# Altium project MT7688A_MODULE_TESTBOARD_DEMO.PrjPcb
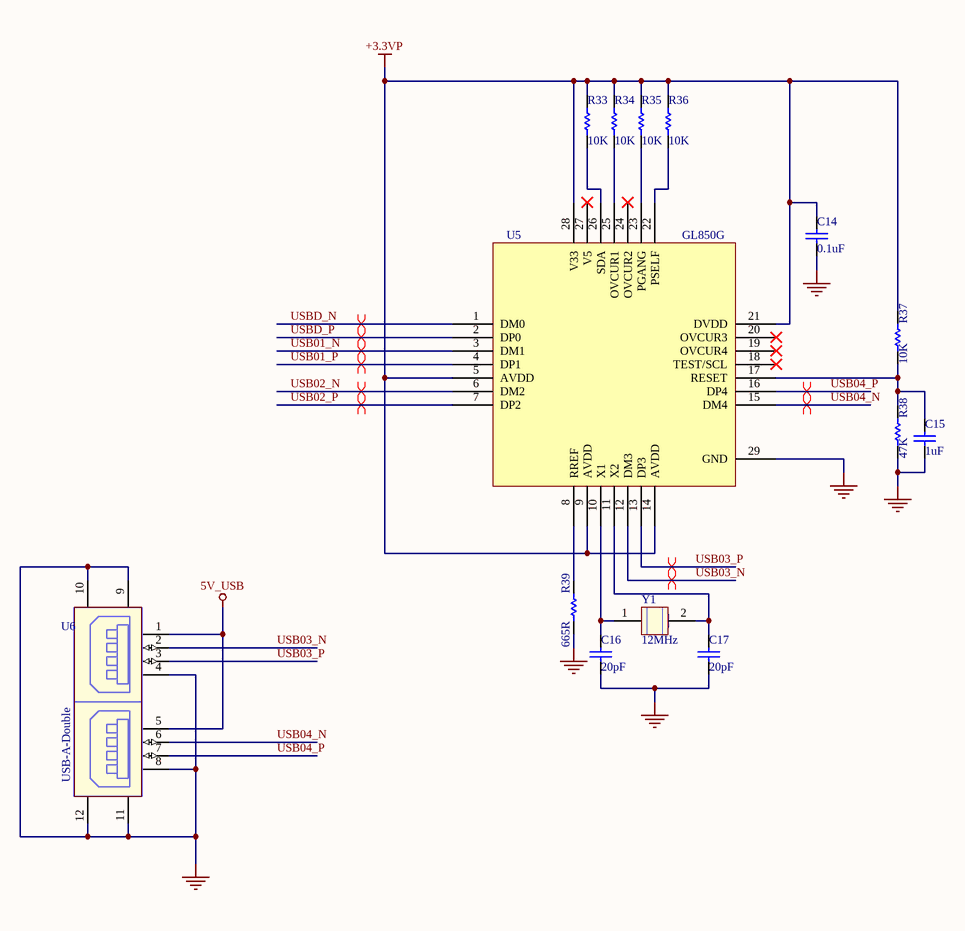
[diagram p0: GL850G.SchDoc]
5 sheets, 123 parts. Net scope: global (net labels, ports and power ports of the same name join across sheets).
Sheets:
  GL850G.SchDoc
  connect.SchDoc
  PCIe.SchDoc
  wm8960.SchDoc
  power.SchDoc

## Sheet GL850G.SchDoc
size A4

### Parts
C14  value 0.1uF  [C0603L]  (hidden comment: Cap Semi)
C15  value 1uF  [C0603L]  (hidden comment: Cap Semi)
C16  value 20pF  [C0603L]  (hidden comment: Cap Semi)
C17  value 20pF  [C0603L]  (hidden comment: Cap Semi)
R33  value 10K  [R0603L]  (hidden comment: Res Semi)
R34  value 10K  [R0603L]  (hidden comment: Res Semi)
R35  value 10K  [R0603L]  (hidden comment: Res Semi)
R36  value 10K  [R0603L]  (hidden comment: Res Semi)
R37  value 10K  [R0603L]  (hidden comment: Res Semi)
R38  value 47K  [R0603L]  (hidden comment: Res Semi)
R39  value 665R  [R0603L]  (hidden comment: Res Semi)
U5  GL850G  [GL850G-QFN28]
U6  USB-A-Double  [USB-DB]
Y1  value 12MHz  [XTAL1]  (hidden comment: Oscillator)

### Nets
5V_USB: U6.1(V+) U6.5(NC)
+3.3VP: C14.1 R33.2 R34.2 R35.2 R36.2 R37.2 U5.5(AVDD) U5.9(AVDD) U5.14(AVDD) U5.21(DVDD) U5.28(V33)
GND: C14.2 C15.2 C16.2 C17.2 R38.1 R39.1 U5.29(GND) U6.4(G) U6.8(NC) U6.9 U6.10 U6.11 U6.12
USB01_N: U5.3(DM1)
USB01_P: U5.4(DP1)
USB02_N: U5.6(DM2)
USB02_P: U5.7(DP2)
USB03_N: U5.12(DM3) U6.2(D-)
USB03_P: U5.13(DP3) U6.3(D+)
USB04_N: U5.15(DM4) U6.6(NC)
USB04_P: U5.16(DP4) U6.7(NC)
USBD_N: U5.1(DM0)
USBD_P: U5.2(DP0)
NetC15_1: C15.1 R37.1 R38.2 U5.17(RESET)
NetC16_1: C16.1 U5.10(X1) Y1.1
NetC17_1: C17.1 U5.11(X2) Y1.2
NetR33_1: R33.1 U5.26(SDA)
NetR34_1: R34.1 U5.25(OVCUR1)
NetR35_1: R35.1 U5.23(PGANG)
NetR36_1: R36.1 U5.22(PSELF)
NetR39_2: R39.2 U5.8(RREF)

Not connected (* = marked no-connect by the designer): U5 18(TEST/SCL)* 19(OVCUR4)* 20(OVCUR3)* 24(OVCUR2)* 27(V5)*

### Layout directives
differential pair: USB01_N, USB01_P, USB02_N, USB02_P, USB03_N, USB03_P, USB04_N, USB04_P, USBD_N, USBD_P

### Library data of the parts
C14-C17 = Cap Semi: Capacitor (Semiconductor SIM Model); Published: 8-Jun-2000; LatestRevisionDate: 17-Jul-2002; LatestRevisionNote: Re-released for DXP Platform.; PackageReference: C1206; Publisher: Altium Limited
R33-R39 = Res Semi: Semiconductor Resistor; Published: 8-Jun-2000; LatestRevisionDate: 17-Jul-2002; LatestRevisionNote: Re-released for DXP Platform.; PackageReference: AXIAL-0.5; Publisher: Altium Limited

## Sheet connect.SchDoc
size A3
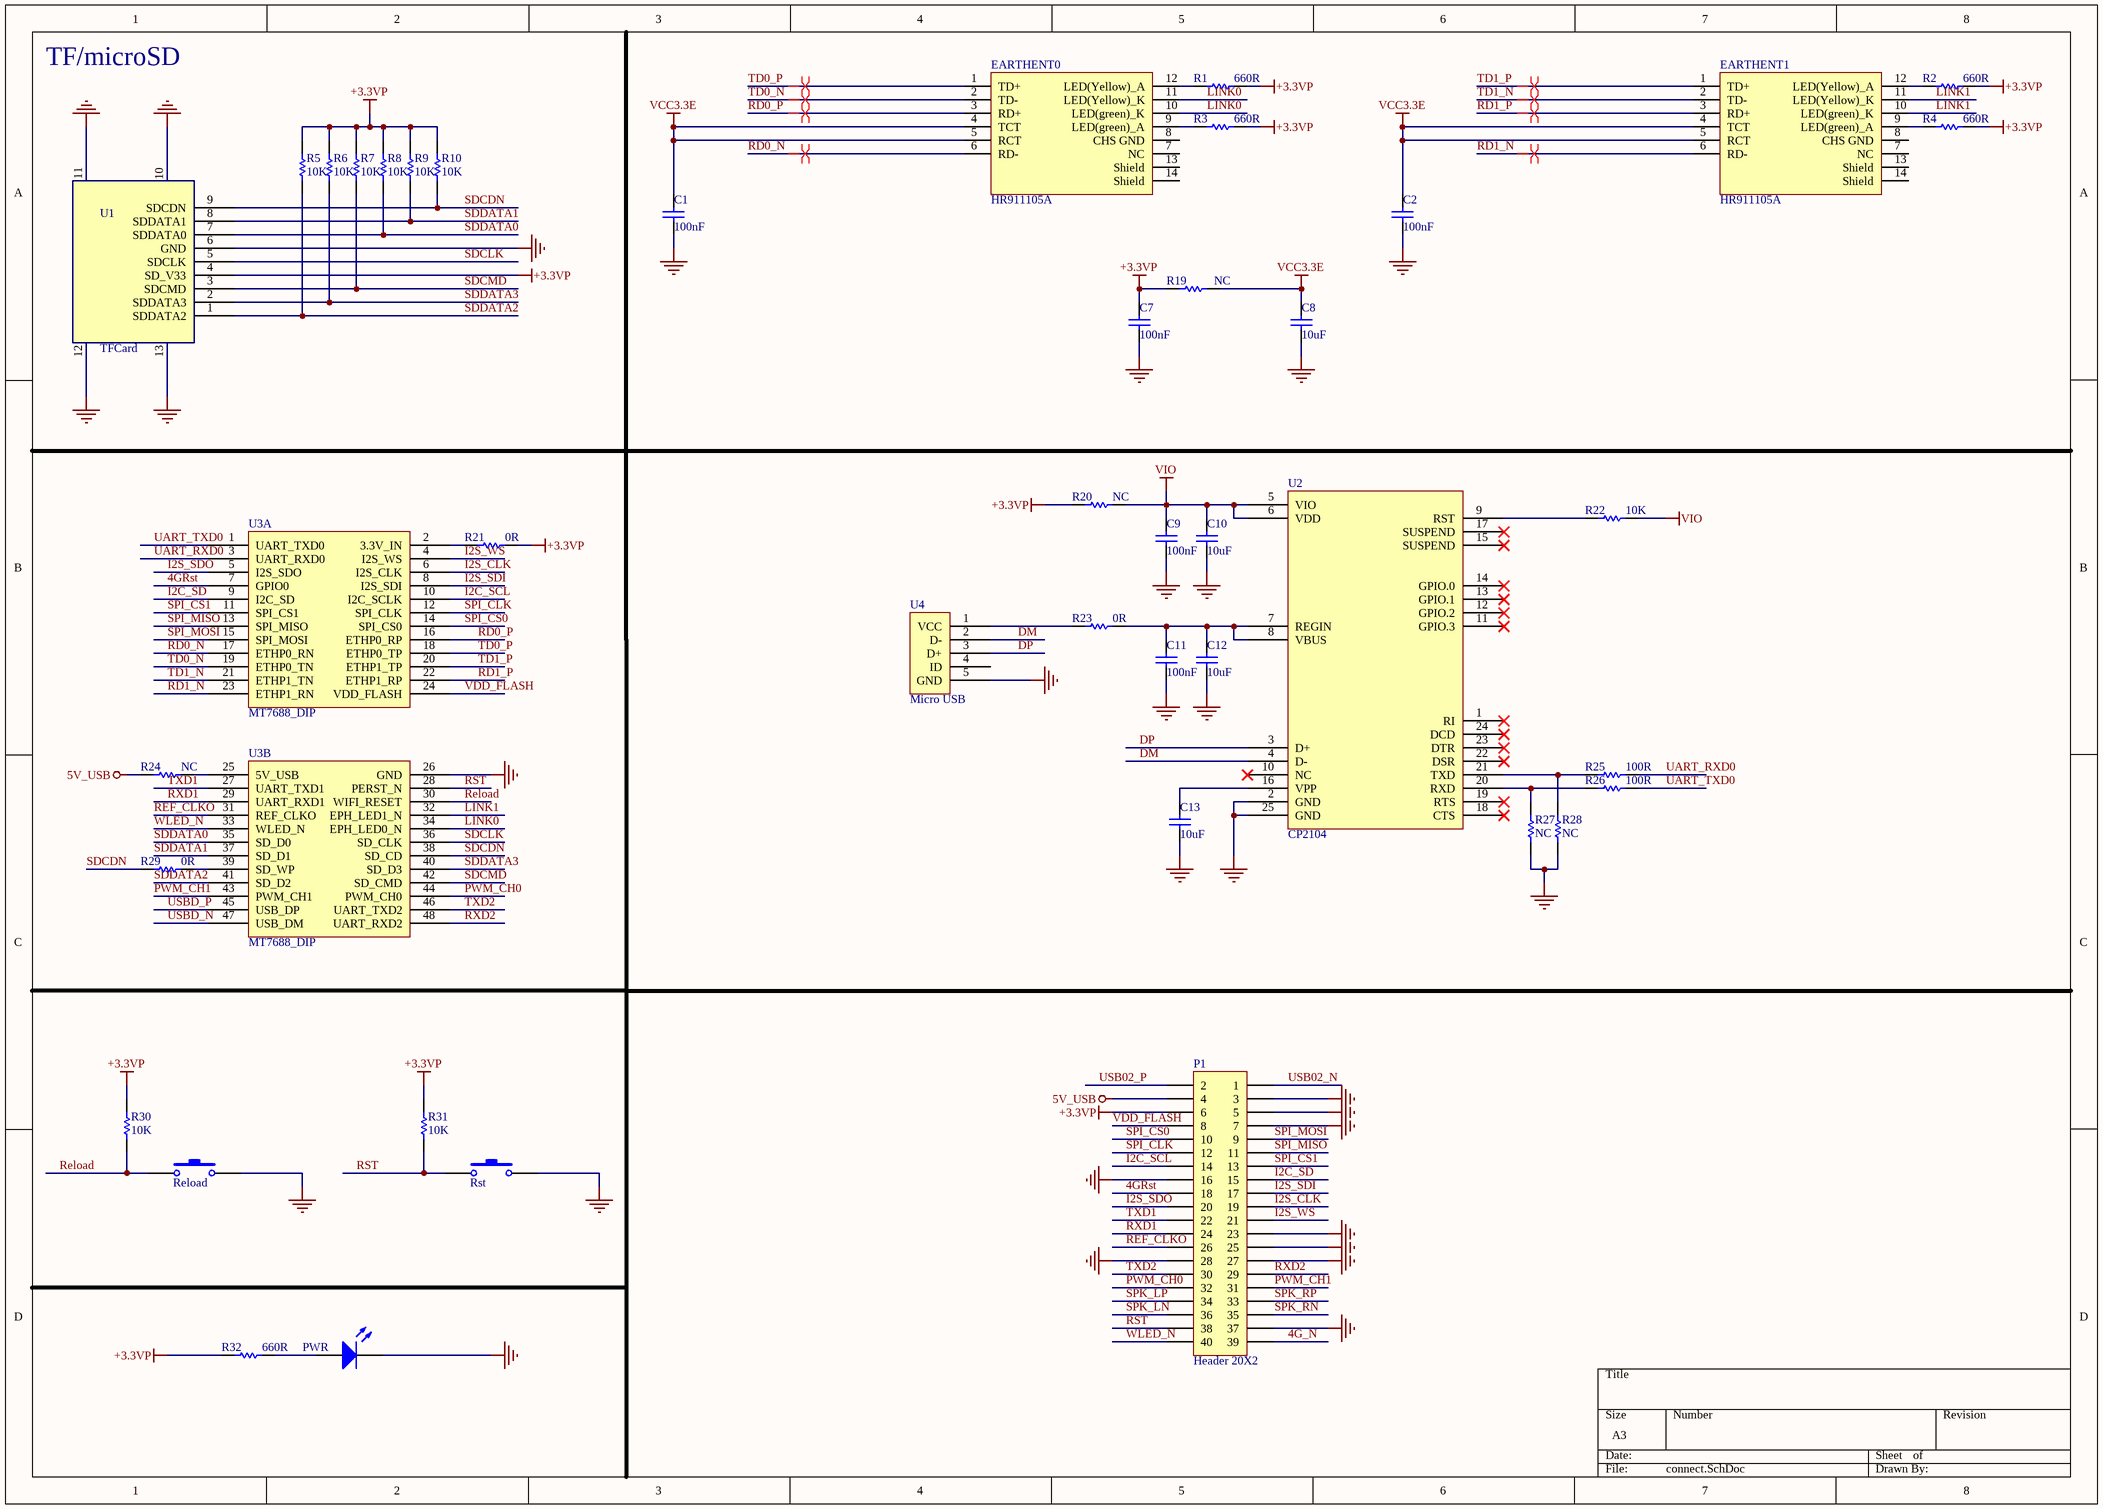
[diagram p1: connect.SchDoc]

### Parts
C1  value 100nF  [C0603L]  (hidden comment: Cap Semi)
C2  value 100nF  [C0603L]  (hidden comment: Cap Semi)
C7  value 100nF  [C0603L]  (hidden comment: Cap Semi)
C8  value 10uF  [C0603L]  (hidden comment: Cap Semi)
C9  value 100nF  [C0603L]  (hidden comment: Cap Semi)
C10  value 10uF  [C0603L]  (hidden comment: Cap Semi)
C11  value 100nF  [C0603L]  (hidden comment: Cap Semi)
C12  value 10uF  [C0603L]  (hidden comment: Cap Semi)
C13  value 10uF  [C0603L]  (hidden comment: Cap Semi)
EARTHENT0  HR911105A  [HR911105A]
EARTHENT1  HR911105A  [HR911105A]
P1  Header 20X2  [HDR2X20]
PWR  leds_0603  [0603LED]  (value not drawn)
R1  value 660R  [R0603L]  (hidden comment: Res Semi)
R2  value 660R  [R0603L]  (hidden comment: Res Semi)
R3  value 660R  [R0603L]  (hidden comment: Res Semi)
R4  value 660R  [R0603L]  (hidden comment: Res Semi)
R5  value 10K  [R0603L]  (hidden comment: Res Semi)
R6  value 10K  [R0603L]  (hidden comment: Res Semi)
R7  value 10K  [R0603L]  (hidden comment: Res Semi)
R8  value 10K  [R0603L]  (hidden comment: Res Semi)
R9  value 10K  [R0603L]  (hidden comment: Res Semi)
R10  value 10K  [R0603L]  (hidden comment: Res Semi)
R19  value NC  [R0603L]  (hidden comment: Res Semi)
R20  value NC  [R0603L]  (hidden comment: Res Semi)
R21  value 0R  [R0603L]  (hidden comment: Res Semi)
R22  value 10K  [R0603L]  (hidden comment: Res Semi)
R23  value 0R  [R0603L]  (hidden comment: Res Semi)
R24  value NC  [R0603L]  (hidden comment: Res Semi)
R25  value 100R  [R0603L]  (hidden comment: Res Semi)
R26  value 100R  [R0603L]  (hidden comment: Res Semi)
R27  value NC  [R0603L]  (hidden comment: Res Semi)
R28  value NC  [R0603L]  (hidden comment: Res Semi)
R29  value 0R  [R0603L]  (hidden comment: Res Semi)
R30  value 10K  [R0603L]  (hidden comment: Res Semi)
R31  value 10K  [R0603L]  (hidden comment: Res Semi)
R32  value 660R  [R0603L]  (hidden comment: Res Semi)
Reload  key  [2x3SWD]  (value not drawn)
Rst  key  [2x3SWD]  (value not drawn)
U1  TFCard  [TFCard-1]
U2  CP2104  [QFN24_4X4]
U3  MT7688_DIP  [MT7688_DIP]  (parts A,B of 2)
U4  Micro USB  [USB-15B1]

### Nets
5V_USB: P1.4 R24.2
+3.3VP: C7.1 P1.6 R1.1 R2.1 R3.1 R4.1 R5.2 R6.2 R7.2 R8.2 R9.2 R10.2 R19.2 R20.2 R21.1 R30.2 R31.2 R32.2 U1.4(SD_V33)
GND: C1.2 C2.2 C7.2 C8.2 C9.2 C10.2 C11.2 C12.2 C13.2 P1.3 P1.5 P1.7 P1.16 P1.23 P1.25 P1.27 P1.28 P1.37 PWR.2(K) R27.2 R28.2 Reload.1 Rst.1 U1.6(GND) U1.10 U1.11 U1.12 U1.13 U2.2(GND) U2.25(GND) U3.26(GND) U4.5(GND)
VCC3.3E: C1.1 C2.1 C8.1 EARTHENT0.4(TCT) EARTHENT0.5(RCT) EARTHENT1.4(TCT) EARTHENT1.5(RCT) R19.1
VIO: C9.1 C10.1 R20.1 R22.1 U2.5(VIO) U2.6(VDD)
4G_N: P1.39
4GRst: P1.18 U3.7(GPIO0)
DM: U2.4(D-) U4.2(D-)
DP: U2.3(D+) U4.3(D+)
I2C_SCL: P1.14 U3.10(I2C_SCLK)
I2C_SD: P1.15 U3.9(I2C_SD)
I2S_CLK: P1.19 U3.6(I2S_CLK)
I2S_SDI: P1.17 U3.8(I2S_SDI)
I2S_SDO: P1.20 U3.5(I2S_SDO)
I2S_WS: P1.21 U3.4(I2S_WS)
LINK0: EARTHENT0.10(LED(green)_K) EARTHENT0.11(LED(Yellow)_K) U3.34(EPH_LED0_N)
LINK1: EARTHENT1.10(LED(green)_K) EARTHENT1.11(LED(Yellow)_K) U3.32(EPH_LED1_N)
PWM_CH0: P1.32 U3.44(PWM_CH0)
PWM_CH1: P1.31 U3.43(PWM_CH1)
RD0_N: EARTHENT0.6(RD-) U3.17(ETHP0_RN)
RD0_P: EARTHENT0.3(RD+) U3.16(ETHP0_RP)
RD1_N: EARTHENT1.6(RD-) U3.23(ETHP1_RN)
RD1_P: EARTHENT1.3(RD+) U3.22(ETHP1_RP)
REF_CLKO: P1.26 U3.31(REF_CLKO)
Reload: R30.1 Reload.2 U3.30(WIFI_RESET)
RST: P1.38 R31.1 Rst.2 U3.28(PERST_N)
RXD1: P1.24 U3.29(UART_RXD1)
RXD2: P1.29 U3.48(UART_RXD2)
SDCDN: R10.1 R29.2 U1.9(SDCDN) U3.38(SD_CD)
SDCLK: U1.5(SDCLK) U3.36(SD_CLK)
SDCMD: R7.1 U1.3(SDCMD) U3.42(SD_CMD)
SDDATA0: R8.1 U1.7(SDDATA0) U3.35(SD_D0)
SDDATA1: R9.1 U1.8(SDDATA1) U3.37(SD_D1)
SDDATA2: R5.1 U1.1(SDDATA2) U3.41(SD_D2)
SDDATA3: R6.1 U1.2(SDDATA3) U3.40(SD_D3)
SPI_CLK: P1.12 U3.12(SPI_CLK)
SPI_CS0: P1.10 U3.14(SPI_CS0)
SPI_CS1: P1.13 U3.11(SPI_CS1)
SPI_MISO: P1.11 U3.13(SPI_MISO)
SPI_MOSI: P1.9 U3.15(SPI_MOSI)
SPK_LN: P1.36
SPK_LP: P1.34
SPK_RN: P1.35
SPK_RP: P1.33
TD0_N: EARTHENT0.2(TD-) U3.19(ETHP0_TN)
TD0_P: EARTHENT0.1(TD+) U3.18(ETHP0_TP)
TD1_N: EARTHENT1.2(TD-) U3.21(ETHP1_TN)
TD1_P: EARTHENT1.1(TD+) U3.20(ETHP1_TP)
TXD1: P1.22 U3.27(UART_TXD1)
TXD2: P1.30 U3.46(UART_TXD2)
UART_RXD0: R25.1 U3.3(UART_RXD0)
UART_TXD0: R26.1 U3.1(UART_TXD0)
USB02_N: P1.1
USB02_P: P1.2
USBD_N: U3.47(USB_DM)
USBD_P: U3.45(USB_DP)
VDD_FLASH: P1.8 U3.24(VDD_FLASH)
WLED_N: P1.40 U3.33(WLED_N)
NetC11_1: C11.1 C12.1 R23.1 U2.7(REGIN) U2.8(VBUS)
NetC13_1: C13.1 U2.16(VPP)
NetEARTHENT0_9: EARTHENT0.9(LED(green)_A) R3.2
NetEARTHENT0_12: EARTHENT0.12(LED(Yellow)_A) R1.2
NetEARTHENT1_9: EARTHENT1.9(LED(green)_A) R4.2
NetEARTHENT1_12: EARTHENT1.12(LED(Yellow)_A) R2.2
NetPWR_1: PWR.1(A) R32.1
NetR21_2: R21.2 U3.2(3.3V_IN)
NetR22_2: R22.2 U2.9(RST)
NetR23_2: R23.2 U4.1(VCC)
NetR24_1: R24.1 U3.25(5V_USB)
NetR25_2: R25.2 R28.1 U2.21(TXD)
NetR26_2: R26.2 R27.1 U2.20(RXD)
NetR29_1: R29.1 U3.39(SD_WP)

Not connected (* = marked no-connect by the designer): EARTHENT0 7(NC) 8(CHS_GND) 13(Shield) 14(Shield); EARTHENT1 7(NC) 8(CHS_GND) 13(Shield) 14(Shield); U2 1(RI)* 10(NC)* 11(GPIO.3)* 12(GPIO.2)* 13(GPIO.1)* 14(GPIO.0)* 15(SUSPEND)* 17(SUSPEND)* 18(CTS)* 19(RTS)* 22(DSR)* 23(DTR)* 24(DCD)*; U4 4(ID)

### Layout directives
differential pair: RD0_N, RD0_P, RD1_N, RD1_P, TD0_N, TD0_P, TD1_N, TD1_P

### Notes on the sheet
- TF/microSD

### Library data of the parts
C1 C2 C7-C13 = Cap Semi: Capacitor (Semiconductor SIM Model); Published: 8-Jun-2000; LatestRevisionDate: 17-Jul-2002; LatestRevisionNote: Re-released for DXP Platform.; PackageReference: C1206; Publisher: Altium Limited
EARTHENT0 EARTHENT1 = HR911105A: Pb-free,接线端子,KF102-3.81-2,2引脚,间距:3.81mm,绿色,额定电压:300V,电流10A,接触电阻：20mΩ,绝缘电阻 5000Ω/1000V,耐压:AC1500V\1min,-40~105℃; Part Number: 3DZ0105115; Specification: Pb-free,接线端子,KF102-3.81-2,2引脚,间距:3.81mm,绿色,额定电压:300V,电流10A,接触电阻：20mΩ,绝缘电阻 5000Ω/1000V,耐压:AC1500V\1min,-40~105℃; Value: *
P1 = Header 20X2: Header, 20-Pin, Dual row; LatestRevisionDate: 17-Jul-2002; LatestRevisionNote: Re-released for DXP Platform.; Publisher: Altium Limited
R1-R10 R19-R32 = Res Semi: Semiconductor Resistor; Published: 8-Jun-2000; LatestRevisionDate: 17-Jul-2002; LatestRevisionNote: Re-released for DXP Platform.; PackageReference: AXIAL-0.5; Publisher: Altium Limited
U4 = USB mini-b

## Sheet PCIe.SchDoc
size A3
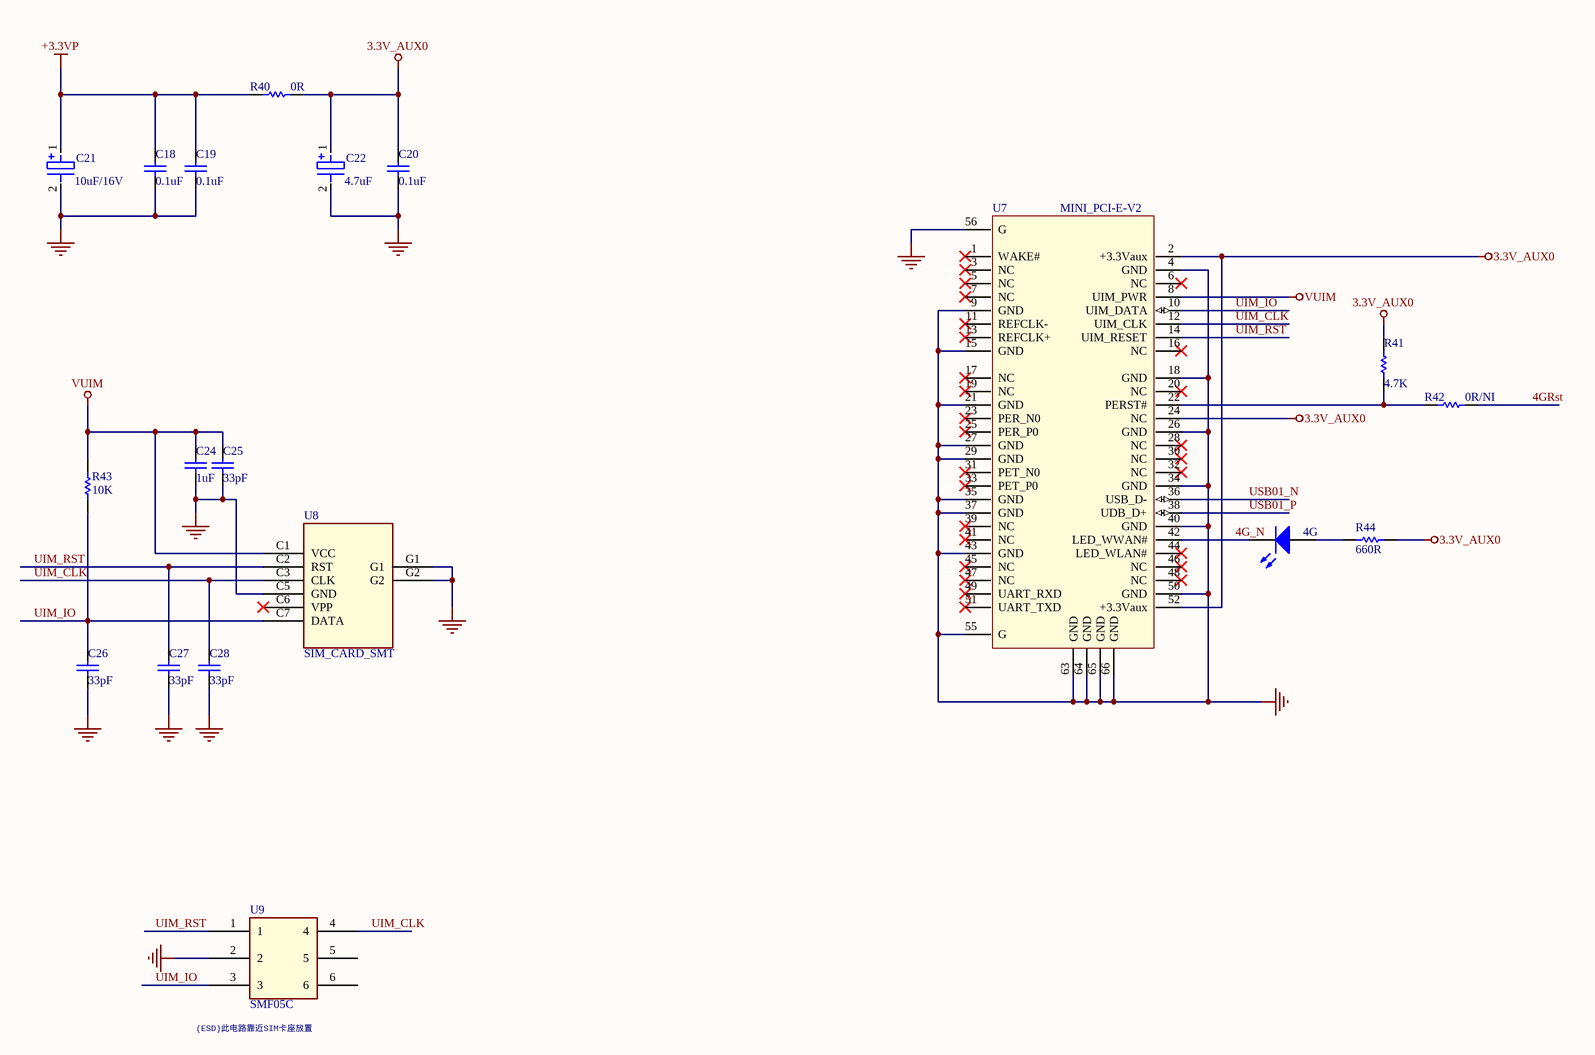
[diagram p2: PCIe.SchDoc]

### Parts
4G  leds_0603  [0603LED]  (value not drawn)
C18  value 0.1uF  [C0603L]  (hidden comment: Cap Semi)
C19  value 0.1uF  [C0603L]  (hidden comment: Cap Semi)
C20  value 0.1uF  [C0603L]  (hidden comment: Cap Semi)
C21  value 10uF/16V  [C0603L]  (hidden comment: Cap Semi)
C22  value 4.7uF  [C0603L]  (hidden comment: Cap Semi)
C24  value 1uF  [C0603L]  (hidden comment: Cap Semi)
C25  value 33pF  [C0603L]  (hidden comment: Cap Semi)
C26  value 33pF  [C0603L]  (hidden comment: Cap Semi)
C27  value 33pF  [C0603L]  (hidden comment: Cap Semi)
C28  value 33pF  [C0603L]  (hidden comment: Cap Semi)
R40  value 0R  [R0603L]  (hidden comment: Res Semi)
R41  value 4.7K  [R0603L]  (hidden comment: Res Semi)
R42  value 0R/NI  [R0603L]  (hidden comment: Res Semi)
R43  value 10K  [R0603L]  (hidden comment: Res Semi)
R44  value 660R  [R0603L]  (hidden comment: Res Semi)
U7  MINI_PCI-E-V2  [MINI_PCI-E_V2]
U8  SIM_CARD_SMT  [SIM_CARD_SMT]
U9  SMF05C  [SMF05C]

### Nets
3.3V_AUX0: C20.2 C22.1 R40.1 R41.1 R44.2 U7.2(+3.3Vaux) U7.24(NC) U7.52(+3.3Vaux)
+3.3VP: C18.2 C19.2 C21.1 R40.2
GND: C18.1 C19.1 C20.1 C21.2 C22.2 C24.2 C25.2 C26.2 C27.2 C28.2 U7.4(GND) U7.9(GND) U7.15(GND) U7.18(GND) U7.21(GND) U7.26(GND) U7.27(GND) U7.29(GND) U7.34(GND) U7.35(GND) U7.37(GND) U7.40(GND) U7.43(GND) U7.50(GND) U7.55(G) U7.56(G) U7.63(GND) U7.64(GND) U7.65(GND) U7.66(GND) U8.C5(GND) U8.G1 U8.G2 U9.2
VUIM: C24.1 C25.1 R43.2 U7.8(UIM_PWR) U8.C1(VCC)
4G_N: 4G.2(K) U7.42(LED_WWAN#)
4GRst: R42.2
UIM_CLK: C28.1 U7.12(UIM_CLK) U8.C3(CLK) U9.4
UIM_IO: C26.1 R43.1 U7.10(UIM_DATA) U8.C7(DATA) U9.3
UIM_RST: C27.1 U7.14(UIM_RESET) U8.C2(RST) U9.1
USB01_N: U7.36(USB_D-)
USB01_P: U7.38(UDB_D+)
Net4G_1: 4G.1(A) R44.1
NetR41_2: R41.2 R42.1 U7.22(PERST#)

Not connected (* = marked no-connect by the designer): U7 1(WAKE#)* 3(NC)* 5(NC)* 6(NC)* 7(NC)* 11(REFCLK-)* 13(REFCLK+)* 16(NC)* 17(NC)* 19(NC)* 20(NC)* 23(PER_N0)* 25(PER_P0)* 28(NC)* 30(NC)* 31(PET_N0)* 32(NC)* 33(PET_P0)* 39(NC)* 41(NC)* 44(LED_WLAN#)* 45(NC)* 46(NC)* 47(NC)* 48(NC)* 49(UART_RXD)* 51(UART_TXD)*; U8 C6(VPP)*; U9 5 6

### Notes on the sheet
- (near U9) (ESD)此电路靠近SIM卡座放置

### Library data of the parts
C18-C20 = Cap: Capacitor; Published: 8-Jun-2000; LatestRevisionDate: 17-Jul-2002; LatestRevisionNote: Re-released for DXP Platform.; PackageReference: RAD-0.3; Publisher: Altium Limited
C21 C22 = CAP3
C24-C28 = Cap Semi: Capacitor (Semiconductor SIM Model); Published: 8-Jun-2000; LatestRevisionDate: 17-Jul-2002; LatestRevisionNote: Re-released for DXP Platform.; PackageReference: C1206; Publisher: Altium Limited
R40-R44 = Res Semi: Semiconductor Resistor; Published: 8-Jun-2000; LatestRevisionDate: 17-Jul-2002; LatestRevisionNote: Re-released for DXP Platform.; PackageReference: AXIAL-0.5; Publisher: Altium Limited

## Sheet wm8960.SchDoc
size A3
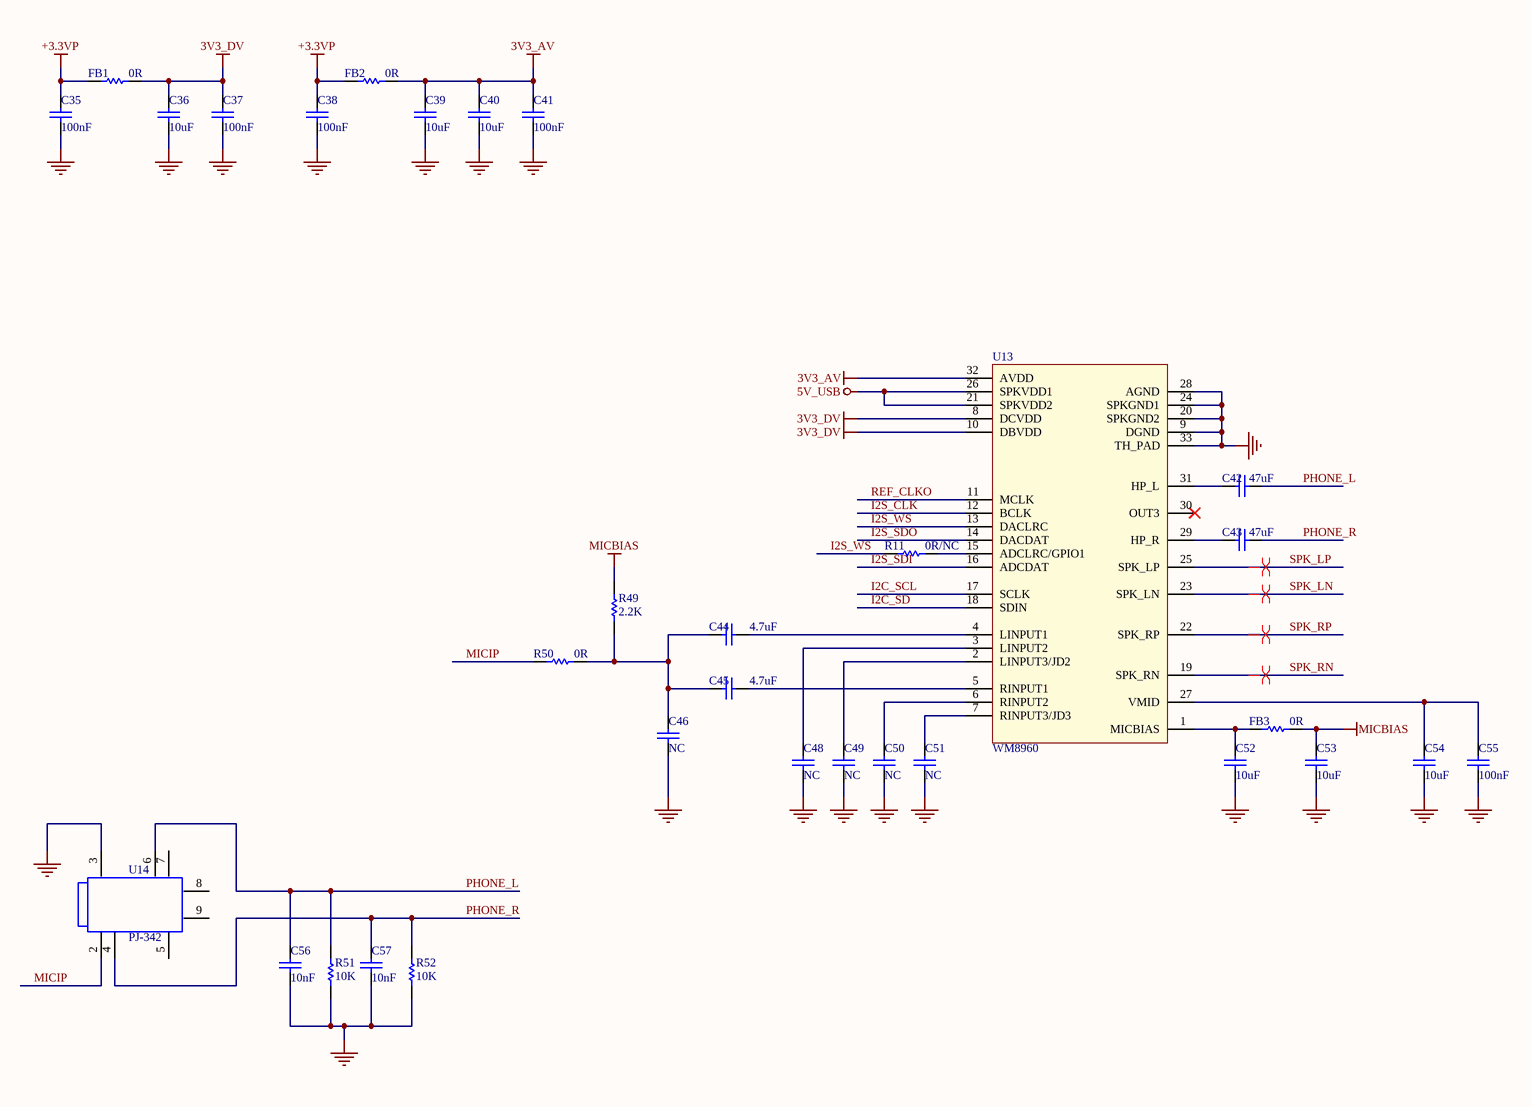
[diagram p3: wm8960.SchDoc]

### Parts
C35  value 100nF  [C0603L]  (hidden comment: Cap Semi)
C36  value 10uF  [C0603L]  (hidden comment: Cap Semi)
C37  value 100nF  [C0603L]  (hidden comment: Cap Semi)
C38  value 100nF  [C0603L]  (hidden comment: Cap Semi)
C39  value 10uF  [C0603L]  (hidden comment: Cap Semi)
C40  value 10uF  [C0603L]  (hidden comment: Cap Semi)
C41  value 100nF  [C0603L]  (hidden comment: Cap Semi)
C42  value 47uF  [C0805L]  (hidden comment: Cap Semi)
C43  value 47uF  [C0805L]  (hidden comment: Cap Semi)
C44  value 4.7uF  [C0603L]  (hidden comment: Cap Semi)
C45  value 4.7uF  [C0603L]  (hidden comment: Cap Semi)
C46  value NC  [C0603L]  (hidden comment: Cap Semi)
C48  value NC  [C0603L]  (hidden comment: Cap Semi)
C49  value NC  [C0603L]  (hidden comment: Cap Semi)
C50  value NC  [C0603L]  (hidden comment: Cap Semi)
C51  value NC  [C0603L]  (hidden comment: Cap Semi)
C52  value 10uF  [C0603L]  (hidden comment: Cap Semi)
C53  value 10uF  [C0603L]  (hidden comment: Cap Semi)
C54  value 10uF  [C0603L]  (hidden comment: Cap Semi)
C55  value 100nF  [C0603L]  (hidden comment: Cap Semi)
C56  value 10nF  [C0603L]  (hidden comment: Cap Semi)
C57  value 10nF  [C0603L]  (hidden comment: Cap Semi)
FB1  value 0R  [R0603L]  (hidden comment: Res Semi)
FB2  value 0R  [R0603L]  (hidden comment: Res Semi)
FB3  value 0R  [R0603L]  (hidden comment: Res Semi)
R11  value 0R/NC  [R0603L]  (hidden comment: Res Semi)
R49  value 2.2K  [R0603L]  (hidden comment: Res Semi)
R50  value 0R  [R0603L]  (hidden comment: Res Semi)
R51  value 10K  [R0603L]  (hidden comment: Res Semi)
R52  value 10K  [R0603L]  (hidden comment: Res Semi)
U13  WM8960  [QFN_32]
U14  PJ-342  [PJ-342_PCB]

### Nets
3V3_AV: C39.1 C40.1 C41.1 FB2.1 U13.32(AVDD)
3V3_DV: C36.1 C37.1 FB1.1 U13.8(DCVDD) U13.10(DBVDD)
5V_USB: U13.21(SPKVDD2) U13.26(SPKVDD1)
+3.3VP: C35.1 C38.1 FB1.2 FB2.2
GND: C35.2 C36.2 C37.2 C38.2 C39.2 C40.2 C41.2 C46.2 C48.2 C49.2 C50.2 C51.2 C52.2 C53.2 C54.2 C55.2 C56.1 C57.1 R51.2 R52.2 U13.9(DGND) U13.20(SPKGND2) U13.24(SPKGND1) U13.28(AGND) U13.33(TH_PAD) U14.3
MICBIAS: C53.1 FB3.1 R49.1
I2C_SCL: U13.17(SCLK)
I2C_SD: U13.18(SDIN)
I2S_CLK: U13.12(BCLK)
I2S_SDI: U13.16(ADCDAT)
I2S_SDO: U13.14(DACDAT)
I2S_WS: R11.2 U13.13(DACLRC)
MICIP: R50.2 U14.2
PHONE_L: C42.2 C56.2 R51.1 U14.6
PHONE_R: C43.2 C57.2 R52.1 U14.4
REF_CLKO: U13.11(MCLK)
SPK_LN: U13.23(SPK_LN)
SPK_LP: U13.25(SPK_LP)
SPK_RN: U13.19(SPK_RN)
SPK_RP: U13.22(SPK_RP)
NetC42_1: C42.1 U13.31(HP_L)
NetC43_1: C43.1 U13.29(HP_R)
NetC44_1: C44.1 C45.1 C46.1 R49.2 R50.1
NetC44_2: C44.2 U13.4(LINPUT1)
NetC45_2: C45.2 U13.5(RINPUT1)
NetC48_1: C48.1 U13.3(LINPUT2)
NetC49_1: C49.1 U13.2(LINPUT3/JD2)
NetC50_1: C50.1 U13.6(RINPUT2)
NetC51_1: C51.1 U13.7(RINPUT3/JD3)
NetC52_1: C52.1 FB3.2 U13.1(MICBIAS)
NetC54_1: C54.1 C55.1 U13.27(VMID)
NetR11_1: R11.1 U13.15(ADCLRC/GPIO1)

Not connected (* = marked no-connect by the designer): U13 30(OUT3)*; U14 5 7 8 9

### Layout directives
differential pair: SPK_LN, SPK_LP, SPK_RN, SPK_RP

### Library data of the parts
C35-C46 C48-C57 = Cap Semi: Capacitor (Semiconductor SIM Model); Published: 8-Jun-2000; LatestRevisionDate: 17-Jul-2002; LatestRevisionNote: Re-released for DXP Platform.; PackageReference: C1206; Publisher: Altium Limited
FB1-FB3 R11 R49-R52 = Res Semi: Semiconductor Resistor; Published: 8-Jun-2000; LatestRevisionDate: 17-Jul-2002; LatestRevisionNote: Re-released for DXP Platform.; PackageReference: AXIAL-0.5; Publisher: Altium Limited

## Sheet power.SchDoc
size A4
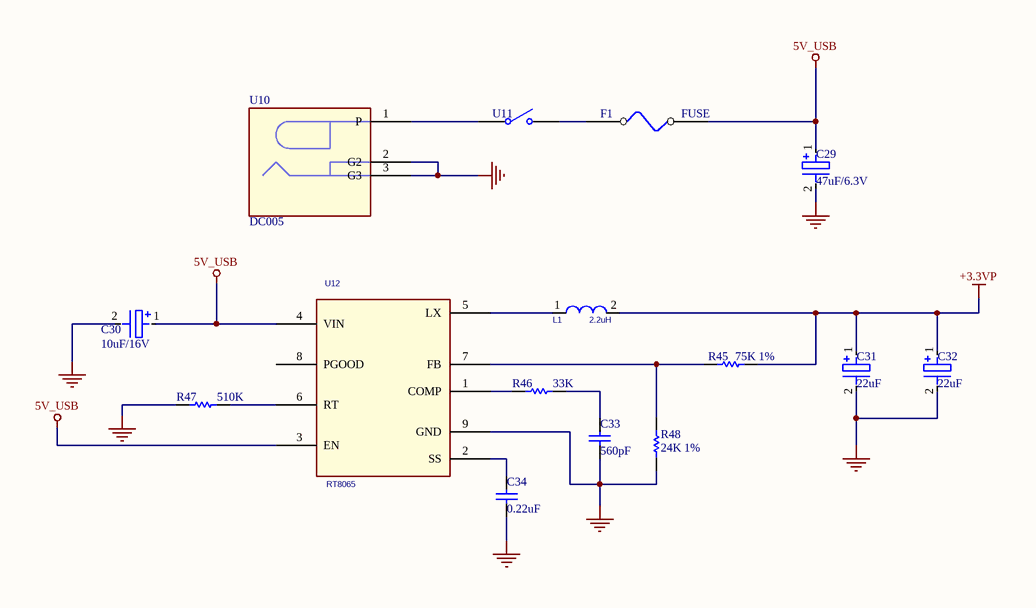
[diagram p4: power.SchDoc]

### Parts
C29  value 47uF/6.3V  [C0805L]  (hidden comment: Cap)
C30  value 10uF/16V  [C0603L]  (hidden comment: Cap)
C31  value 22uF  [C0805L]  (hidden comment: Cap)
C32  value 22uF  [C0805L]  (hidden comment: Cap)
C33  value 560pF  [C0603L]  (hidden comment: Cap Semi)
C34  value 0.22uF  [C0603L]  (hidden comment: Cap Semi)
F1  FUSE  [FS_1206]
L1  2.2uH  [L3X3MM]
R45  value 75K 1%  [R0603L]  (hidden comment: Res Semi)
R46  value 33K  [R0603L]  (hidden comment: Res Semi)
R47  value 510K  [R0603L]  (hidden comment: Res Semi)
R48  value 24K 1%  [R0603L]  (hidden comment: Res Semi)
U10  DC005  [DC005]
U11  switch_on_off  [switch_bodong]  (value not drawn)
U12  RT8065  [soic8-lh]

### Nets
5V_USB: C29.1 C30.1 F1.2 U12.3(EN) U12.4(VIN)
+3.3VP: C31.1 C32.1 L1.2 R45.2
GND: C29.2 C30.2 C31.2 C32.2 C33.2 C34.2 R47.2 R48.2 U10.2(G2) U10.3(G3) U12.9(GND)
NetC33_1: C33.1 R46.1
NetC34_1: C34.1 U12.2(SS)
NetF1_1: F1.1 U11.2(NO)
NetL1_1: L1.1 U12.5(LX)
NetR45_1: R45.1 R48.1 U12.7(FB)
NetR46_2: R46.2 U12.1(COMP)
NetR47_1: R47.1 U12.6(RT)
NetU10_1: U10.1(P) U11.1(COMMON)

Not connected (* = marked no-connect by the designer): U12 8(PGOOD)

### Library data of the parts
C29-C32 = CAP3
C33 C34 = Cap Semi: Capacitor (Semiconductor SIM Model); Published: 8-Jun-2000; LatestRevisionDate: 17-Jul-2002; LatestRevisionNote: Re-released for DXP Platform.; PackageReference: C1206; Publisher: Altium Limited
L1 = LQH32C_0_Dup1
R45-R48 = Res Semi: Semiconductor Resistor; Published: 8-Jun-2000; LatestRevisionDate: 17-Jul-2002; LatestRevisionNote: Re-released for DXP Platform.; PackageReference: AXIAL-0.5; Publisher: Altium Limited

## Nets that join several sheets
5V_USB: GL850G (U6.1 U6.5), connect (P1.4 R24.2), wm8960 (U13.21 U13.26), power (5 pins)
+3.3VP: GL850G (11 pins), connect (19 pins), PCIe (C18.2 C19.2 C21.1 R40.2), wm8960 (C35.1 C38.1 FB1.2 FB2.2), power (C31.1 C32.1 L1.2 R45.2)
GND: GL850G (13 pins), connect (32 pins), PCIe (34 pins), wm8960 (26 pins), power (11 pins)
4G_N: connect (P1.39), PCIe (4G.2 U7.42)
4GRst: connect (P1.18 U3.7), PCIe (R42.2)
I2C_SCL: connect (P1.14 U3.10), wm8960 (U13.17)
I2C_SD: connect (P1.15 U3.9), wm8960 (U13.18)
I2S_CLK: connect (P1.19 U3.6), wm8960 (U13.12)
I2S_SDI: connect (P1.17 U3.8), wm8960 (U13.16)
I2S_SDO: connect (P1.20 U3.5), wm8960 (U13.14)
I2S_WS: connect (P1.21 U3.4), wm8960 (R11.2 U13.13)
REF_CLKO: connect (P1.26 U3.31), wm8960 (U13.11)
SPK_LN: connect (P1.36), wm8960 (U13.23)
SPK_LP: connect (P1.34), wm8960 (U13.25)
SPK_RN: connect (P1.35), wm8960 (U13.19)
SPK_RP: connect (P1.33), wm8960 (U13.22)
USB01_N: GL850G (U5.3), PCIe (U7.36)
USB01_P: GL850G (U5.4), PCIe (U7.38)
USB02_N: GL850G (U5.6), connect (P1.1)
USB02_P: GL850G (U5.7), connect (P1.2)
USBD_N: GL850G (U5.1), connect (U3.47)
USBD_P: GL850G (U5.2), connect (U3.45)